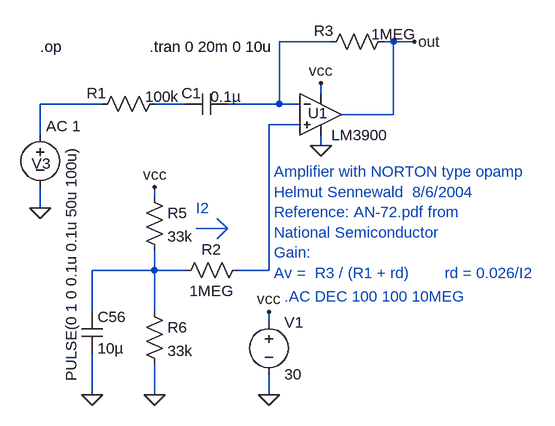
[diagram p0: schematic LM3900_x10.asc]
LM3900_x10.asc, the LTspice schematic file:
Version 4
SHEET 1 2576 884
WIRE -528 16 -608 16
WIRE -432 16 -448 16
WIRE -400 16 -432 16
WIRE -544 96 -544 80
WIRE -880 112 -976 112
WIRE -752 112 -800 112
WIRE -608 112 -608 16
WIRE -608 112 -688 112
WIRE -576 112 -608 112
WIRE -432 128 -432 16
WIRE -432 128 -512 128
WIRE -576 144 -624 144
WIRE -976 160 -976 112
WIRE -544 176 -544 160
WIRE -800 256 -800 240
WIRE -976 272 -976 240
WIRE -800 368 -800 336
WIRE -800 368 -896 368
WIRE -752 368 -800 368
WIRE -624 368 -624 144
WIRE -624 368 -672 368
WIRE -896 432 -896 368
WIRE -800 432 -800 368
WIRE -624 448 -624 432
WIRE -896 560 -896 496
WIRE -800 560 -800 512
WIRE -624 560 -624 528
FLAG -400 16 out
FLAG -624 560 0
FLAG -624 432 vcc
FLAG -544 176 0
FLAG -544 80 vcc
FLAG -800 560 0
FLAG -976 272 0
FLAG -800 240 vcc
FLAG -896 560 0
SYMBOL res -544 32 R270
WINDOW 0 17 5 VTop 0
WINDOW 3 43 112 VBottom 0
SYMATTR InstName R3
SYMATTR Value 1MEG
SYMBOL voltage -624 432 R0
SYMATTR InstName V1
SYMATTR Value 30
SYMBOL res -896 128 R270
WINDOW 0 17 7 VTop 0
WINDOW 3 43 108 VBottom 0
SYMATTR InstName R1
SYMATTR Value 100k
SYMBOL res -768 384 R270
WINDOW 0 32 56 VTop 0
WINDOW 3 0 56 VBottom 0
SYMATTR InstName R2
SYMATTR Value 1MEG
SYMBOL voltage -976 144 R0
WINDOW 3 48 31 VRight 0
WINDOW 123 9 2 Left 0
WINDOW 39 0 0 Left 0
WINDOW 0 -13 60 Left 0
SYMATTR Value PULSE(0 1 0 0.1u 0.1u 50u 100u)
SYMATTR Value2 AC 1
SYMATTR InstName V3
SYMBOL cap -752 128 R270
WINDOW 0 17 9 VTop 0
WINDOW 3 43 62 VBottom 0
SYMATTR InstName C1
SYMATTR Value 0.1µ
SYMBOL res -816 240 R0
SYMATTR InstName R5
SYMATTR Value 33k
SYMBOL res -816 416 R0
SYMATTR InstName R6
SYMATTR Value 33k
SYMBOL cap -912 432 R0
SYMATTR InstName C56
SYMATTR Value 10µ
SYMBOL OpAmp.Add\\LM3900 -544 64 R0
WINDOW 0 -20 62 Left 0
WINDOW 38 62 33 Center 0
SYMATTR InstName U1
TEXT -976 24 Left 0 !.op
TEXT -600 408 Left 0 ;.AC DEC 100 100 10MEG
TEXT -808 24 Left 0 !.tran 0 20m 0 10u
TEXT -616 216 Left 0 ;Amplifier with NORTON type opamp\nHelmut Sennewald  8/6/2004\nReference: AN-72.pdf from\nNational Semiconductor \nGain: \nAv =  R3 / (R1 + rd)        rd = 0.026/I2
TEXT -736 272 Left 0 ;I2
LINE Normal -688 304 -736 304
LINE Normal -704 288 -688 304
LINE Normal -704 320 -688 304

The netlist it stands for:
* LM3900_x10.asc
R3 N001 out 1MEG
V1 vcc 0 30
R1 N002 N003 100k
R2 N005 N004 1MEG
V3 N002 0 PULSE(0 1 0 0.1u 0.1u 50u 100u) AC 1
C1 N003 N001 0.1µ
R5 vcc N005 33k
R6 N005 0 33k
C56 N005 0 10µ
* U1: LM3900 (symbol OpAmp.Add\LM3900 not available, pins judged from their places): In+=N004 In-=N001 V+=vcc V-=0 OUT=out
.op
* .AC DEC 100 100 10MEG
.tran 0 20m 0 10u
* Amplifier with NORTON type opamp
* Helmut Sennewald  8/6/2004
* Reference: AN-72.pdf from
* National Semiconductor
* Gain:
* Av =  R3 / (R1 + rd)        rd = 0.026/I2
* I2
.backanno
.end